# EAGLE design PowerBoard (EAGLE 7.5.0)
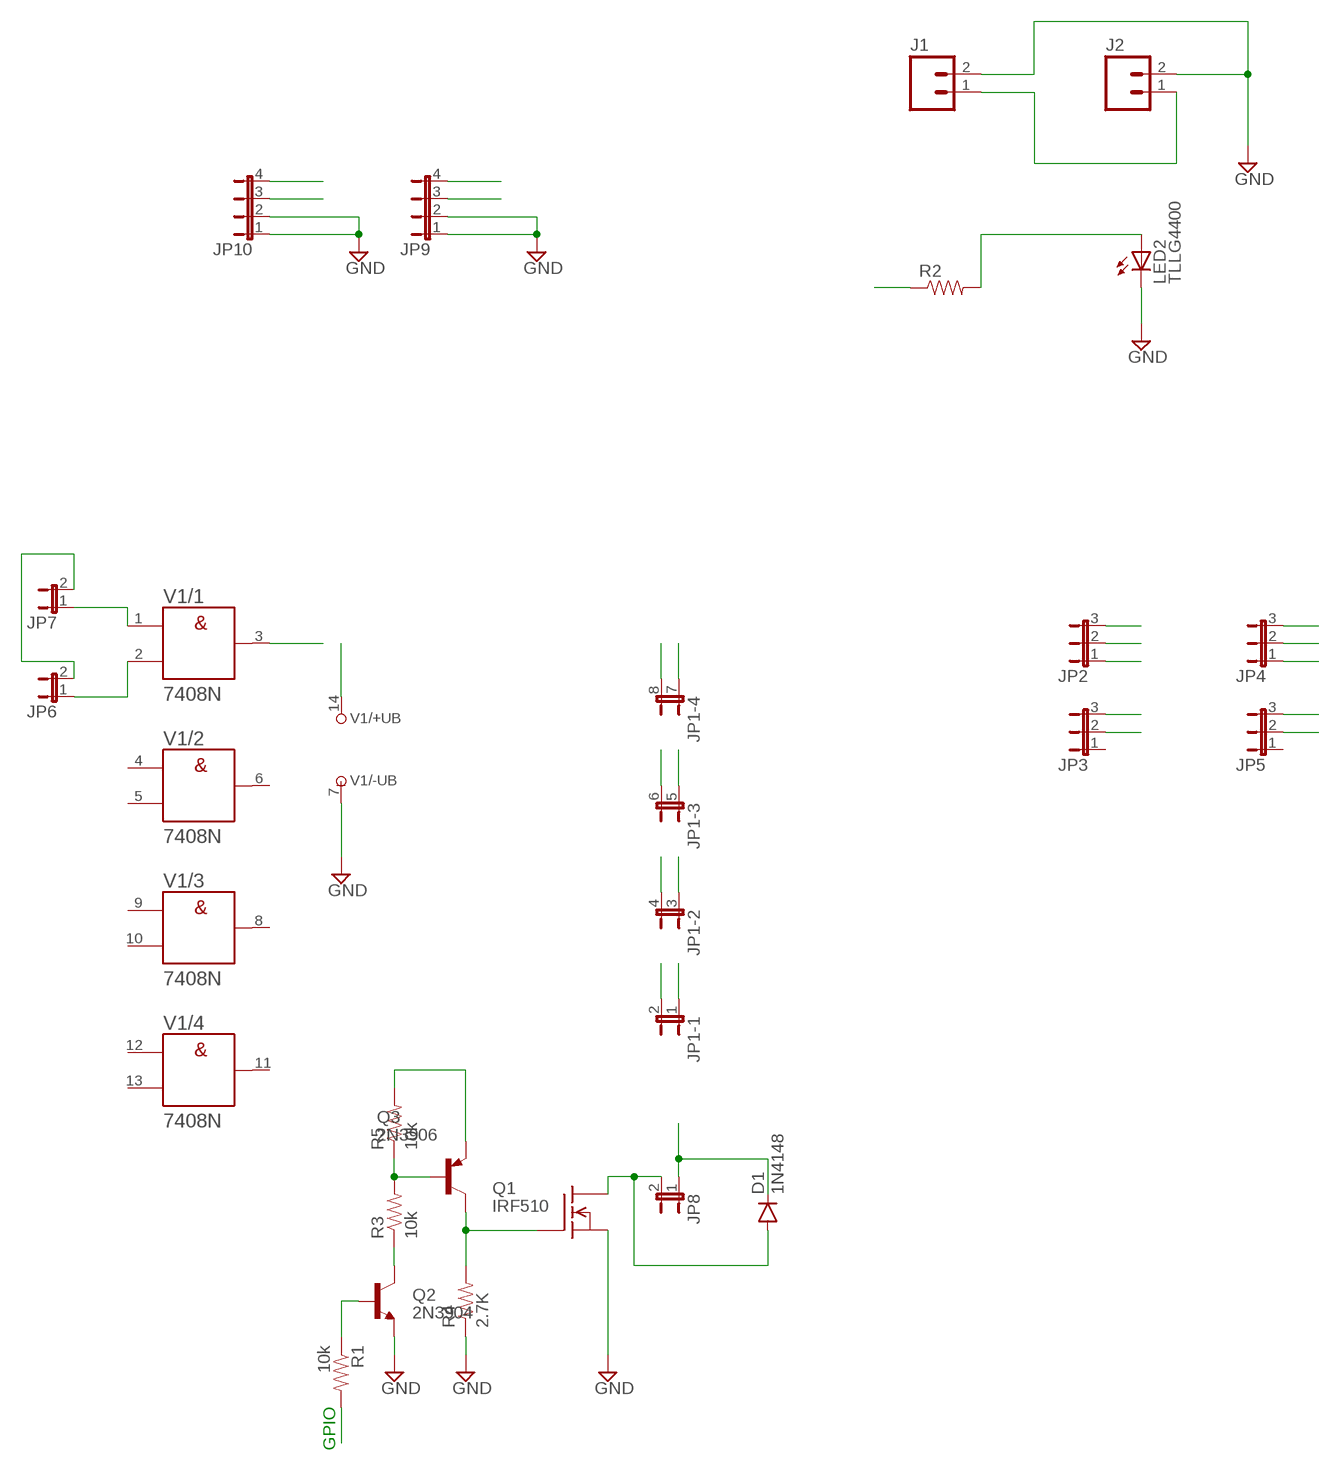
[diagram p0: schematic, sheet 1]

## Parts
D1  1N4148  DIODE1N4148  [DIODE-1N4148]
J1  M02JST-PTH-2  [JST-2-PTH]
J2  M02JST-PTH-2  [JST-2-PTH]
JP1  JP4QE  [JP4Q]
JP2  JP2E  [JP2]
JP3  JP2E  [JP2]
JP4  JP2E  [JP2]
JP5  JP2E  [JP2]
JP6  JP1E  [JP1]
JP7  JP1E  [JP1]
JP8  JP1E  [JP1]
JP9  JP4E  [JP4]
JP10  JP4E  [JP4]
LED2  TLLG4400  [LED3MM]
Q1  IRF510  [TO220]
Q2  2N3904  TRANSISTOR_NPN2N3904  [TO-92]
Q3  2N3906  [TO92]
R1  10k  RESISTORPTH-1/4W  [AXIAL-0.4]
R2  RESISTORPTH-1/4W  [AXIAL-0.4]
R3  10k  RESISTORPTH-1/4W  [AXIAL-0.4]
R4  2.7K  RESISTORPTH-1/4W  [AXIAL-0.4]
R5  10k  RESISTORPTH-1/4W  [AXIAL-0.4]
V1  7408N  [DIL14]

## Nets
1.8VCC: JP1.3 JP2.1
5VCC: JP1.7 JP4.1 JP10.3 R2.P$1 V1.14(/+UB:+UB)
15VCC: D1.C J1.1 J2.1 JP8.1 JP9.3 Q3.3(E) R5.P$2
ANDIN2: JP6.1 V1.2(/1:B)
FLOAT1: JP1.8
FLOAT2: JP1.6
FLOAT3: JP10.4
FLOAT4: JP9.4
GND: J1.2 J2.2 JP1.5 JP3.3 JP5.3 JP9.1 JP9.2 JP10.1 JP10.2 LED2.K(C) Q1.3(S) Q2.1(E) R4.P$1 V1.7(/-UB:-UB)
GPIO3: Q2.2(B) R1.P$1
HV1: JP4.3 JP6.2 JP7.2
HV2: JP4.2 V1.3(/1:Y)
HV3: JP5.2
KICKER: JP1.4 R1.P$2
LV1: JP1.1 JP2.3
LV2: JP1.2 JP2.2
LV3: JP3.2
N$1: Q2.3(C) R3.P$1
N$2: Q3.2(B) R3.P$2 R5.P$1
N$3: D1.A JP8.2 Q1.2(D)
N$4: Q1.1(G) Q3.1(C) R4.P$2
N$6: JP7.1 V1.1(/1:A)
N$7: LED2.A R2.P$2
Unconnected: JP3.1 JP5.1 V1.4(/2:A) V1.5(/2:B) V1.6(/2:Y) V1.8(/3:Y) V1.9(/3:A) V1.10(/3:B) V1.11(/4:Y) V1.12(/4:A) V1.13(/4:B)

## Notes on the sheet
- GPIO

## Library data of the parts
D1 = SparkFun-DiscreteSemi:DIODE: Diode These are standard reverse protection diodes and small signal diodes. SMA package can handle up to about 1A. SOD-323 can handle about 200mA. What the SOD-323 package when ordering, there are some mfgs out there that are 5-pin packages.; PROD_ID: DIO-08378
J1 J2 = SparkFun-Connectors:M02: Standard 2-pin 0.1" header. Use with - straight break away headers ( PRT-00116) - right angle break away headers (PRT-00553) - swiss pins (PRT-00743) - machine pins (PRT-00117) - female headers (PRT-00115) Molex polarized connector foot print use with: PRT-08233 with associated crimp pins and housings. 2.54_SCREWTERM for use with PRT-10571. 3.5mm Screw Terminal footprints for PRT-08084 5mm Screw Terminal footprints for use with PRT-08432; PROD_ID: CONN-09863; SKU: PRT-09914
JP1 = jumper:JP4QE: JUMPER
JP2-JP5 = jumper:JP2E: JUMPER
JP6-JP8 = jumper:JP1E: JUMPER
JP9 JP10 = jumper:JP4E: JUMPER
LED2 = led:TLLG4400: Low Current (2mA) LED 3 mm Tinted Diffused Package color GREEN Source: Data sheet <http://www.farnell.com/datasheets/391098.pdf>; MF: VISHAY SEMICONDUCTOR; OC_FARNELL: 1612435
Q1 = transistor-fet:IRF510: N-Channel Enhancement MOSFET (HEXFET); 100V; 5,6A; 0,54Ohm
Q2 = SparkFun-DiscreteSemi:TRANSISTOR_NPN: Generic NPN BJT MMBT2222A - TRANS-08049 (SOT-23, 1A 40V) MPSA42 - TRANS-09116 (SOT-23, 500mA 300V) MMBT5088LT1G - TRANS-11160 (SOT-23, 50 mA 30V) BC547 - COM-08928 <http://www.sparkfun.com/products/8928> (TO-92 45V 100mA) (1.Collector 2.Base 3.Emitter) 2N3904 - COM-00521 <http://www.sparkfun.com/products/521> (TO-92 40V 200mA) (1.Emitter 2.Base 3.Collector) P2N2222A - COM-12852 <http://www.sparkfun.com/products/12852> (TO-92 40V 600mA) (1.Collector 2.Base 3.Emitter); PROD_ID: TRANS-08447
Q3 = transistor-pnp:2N3906: PNP Transistor
R1 R2 = SparkFun-Resistors:RESISTOR: Resistor Basic schematic elements and footprints for 0603, 1206, and PTH resistors.
R3-R5 = SparkFun-Passives:RESISTOR: Resistor Basic schematic elements and footprints for 0603, 1206, and PTH resistors.
V1 = 74ttl-din:74*08: Quad 2-input AND gate

## Board
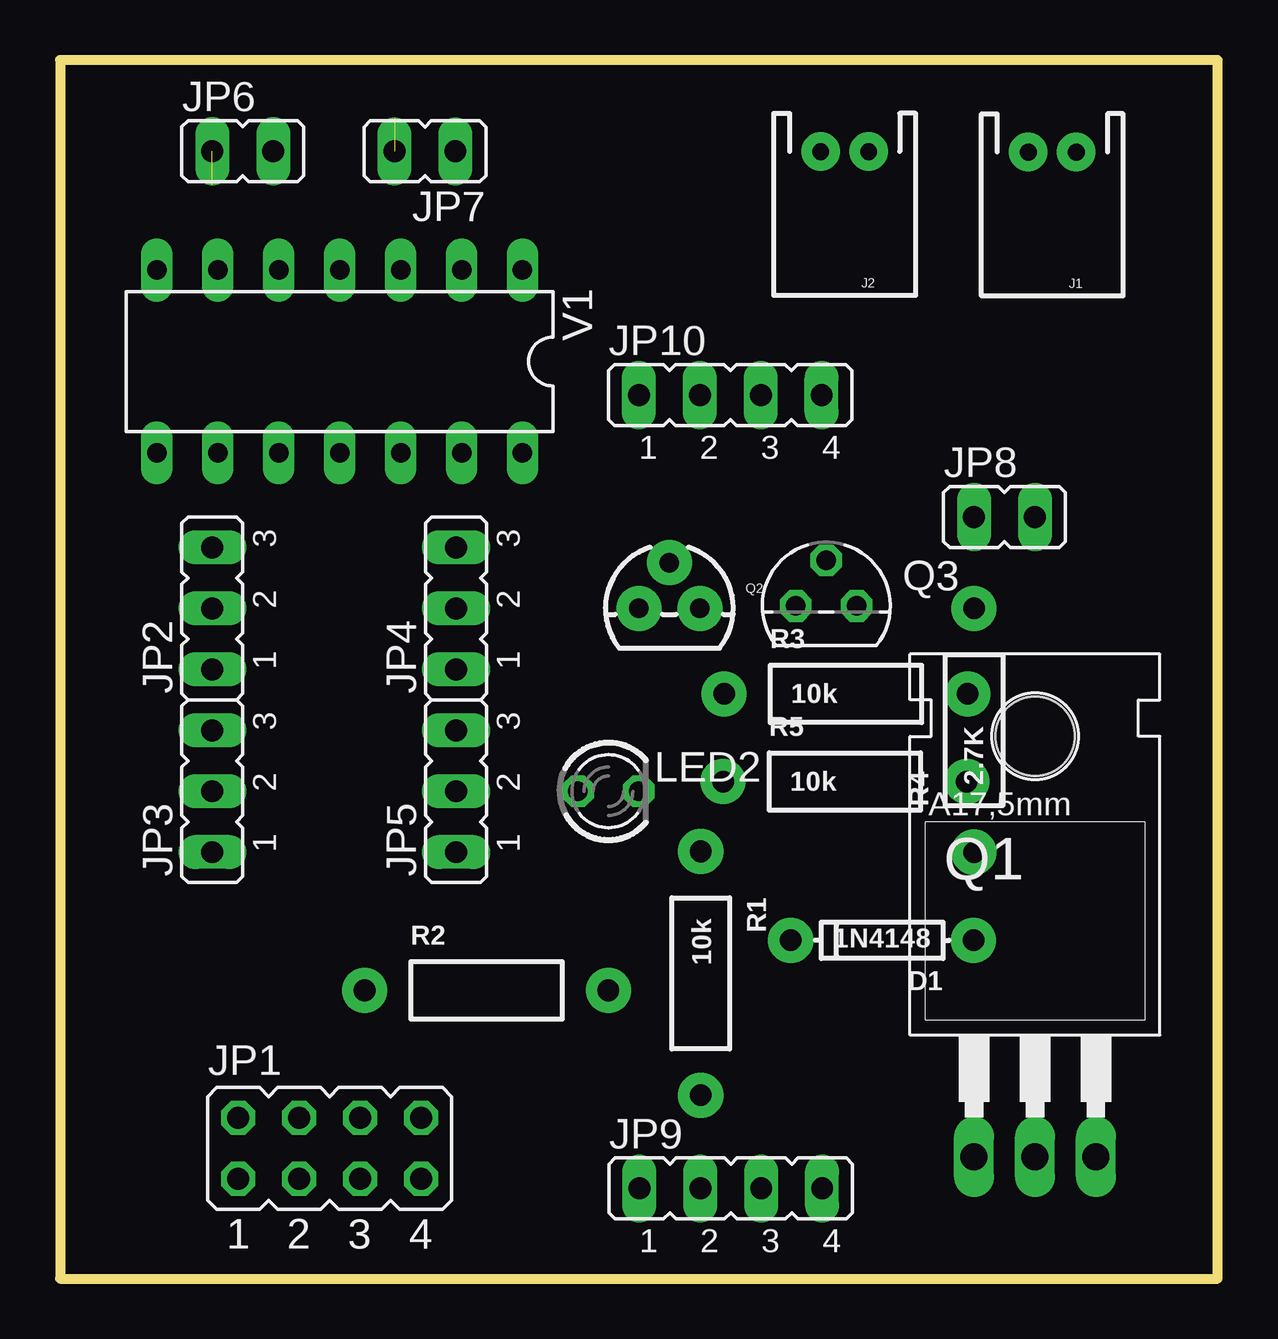
[diagram p1: board, top side]
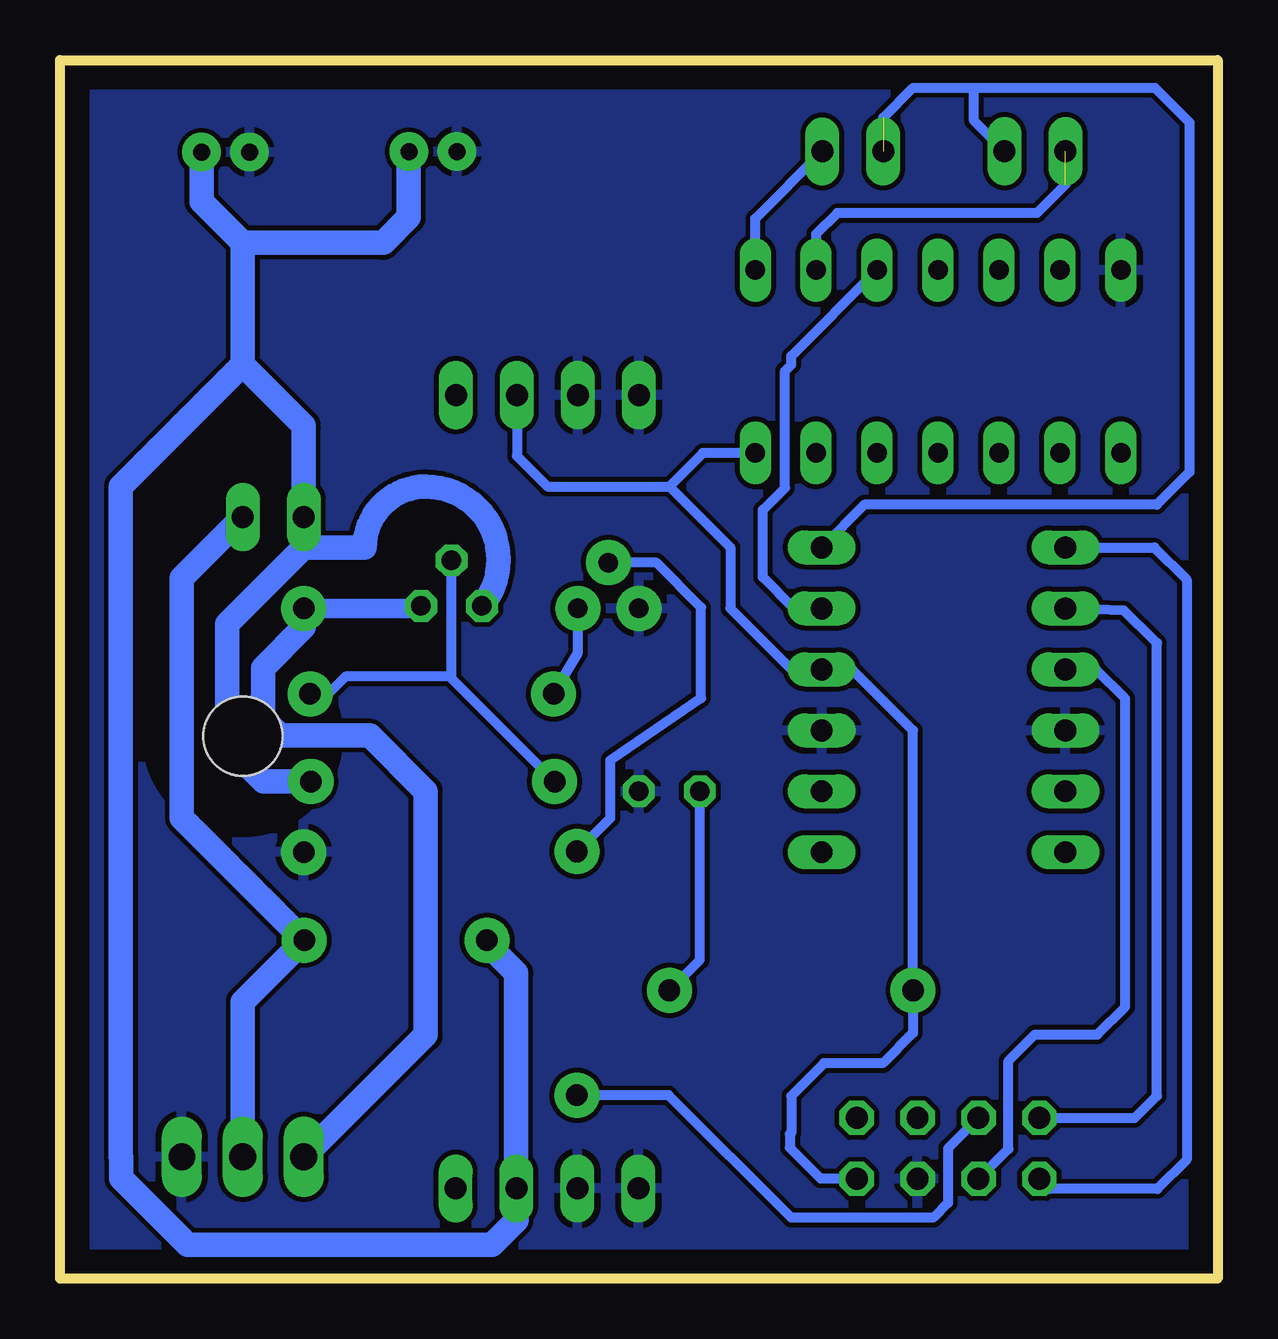
[diagram p2: board, bottom side, seen from below]

Size 48.26 x 50.8 mm. Coordinates in mm from the lower left corner, seen from the top.
Outline: 0,50.8 0,0 48.26,0 48.26,50.8 0,50.8
Copper layers (1*16): Top 0.035mm / dielectric 1.5mm / Bottom 0.035mm
Design rules "default": minimum track width 10mil, minimum drill 24mil, track to track 8mil, track to pad 8mil, pad to pad 8mil, via to via 8mil, smd to smd 8mil, copper to edge 40mil, drill to drill 8mil, minimum pad ring 10mil, minimum via ring 8mil, stop-mask expansion 4mil, vias tented up to drill 0mil, thermal gap 10mil

### Footprints (pad centres in the part's own frame; a part is rotated, then mirrored left to right if it is on the bottom)
DIODE-1N4148 = drill 0.9 pad 1.88: A -3.81,0; C 3.81,0
JST-2-PTH = drill 0.7 pad 1.6: 1 -1,0; 2 1,0
JP4Q = drill 0.914 octagon: 1 -3.81,-1.27; 2 -3.81,1.27; 3 -1.27,-1.27; 4 -1.27,1.27; 5 1.27,-1.27; 6 1.27,1.27; 7 3.81,-1.27; 8 3.81,1.27
JP2 = drill 0.914 long: 1 -2.54,0; 2 0,0; 3 2.54,0
JP1 = drill 0.914 long: 1 0,-1.27; 2 0,1.27
JP4 = drill 0.914 long: 1 -3.81,0; 2 -1.27,0; 3 1.27,0; 4 3.81,0
LED3MM = drill 0.813 octagon: A -1.27,0; K 1.27,0
TO220 = drill 1.118 long: 1 -2.54,-6.35; 2 0,-6.35; 3 2.54,-6.35 | hole 3.302: 0,11.176
TO-92 = drill 0.813 pad 1.88: 1 -1.27,0; 2 0,1.905; 3 1.27,0
TO92 = drill 0.813 octagon: 1 1.27,0; 2 0,1.905; 3 -1.27,0
AXIAL-0.4 = drill 0.9 pad 1.88: P$1 -5.08,0; P$2 5.08,0
DIL14 = drill 0.813 long: 1 -7.62,-3.81; 2 -5.08,-3.81; 3 -2.54,-3.81; 4 0,-3.81; 5 2.54,-3.81; 6 5.08,-3.81; 7 7.62,-3.81; 8 7.62,3.81; 9 5.08,3.81; 10 2.54,3.81; 11 0,3.81; 12 -2.54,3.81; 13 -5.08,3.81; 14 -7.62,3.81

### Placement (x,y rotation side)
D1  34.27,14.11 180 top
J1  41.36,46.96 180 top
J2  32.71,46.98 180 top
JP1  11.24,5.43 0 top
JP2  6.35,27.94 90 top
JP3  6.35,20.32 90 top
JP4  16.51,27.94 90 top
JP5  16.51,20.32 90 top
JP6  7.62,47 270 top
JP7  15.21,46.99 90 top
JP8  39.37,31.75 270 top
JP9  27.96,3.76 0 top
JP10  27.94,36.83 0 top
LED2  22.86,20.32 0 top
Q1  40.64,11.43 0 top
Q2  25.4,27.94 0 top
Q3  31.94,28.04 0 top
R1  26.71,12.73 270 top
R2  17.78,12.02 0 top
R3  32.76,24.38 0 top
R4  38.1,22.86 90 top
R5  32.72,20.72 0 top
V1  11.66,38.23 180 top

### Tracks (layer width: path | path; a pad name or v marks a point on that pad's centre or on a via)
1.8VCC
  Bottom 0.406: JP1.3 8.72,5.41 8.72,9.08 7.62,10.18 5.02,10.18 3.86,11.34 3.86,24.18 5.08,25.4 JP2.1
5VCC
  Bottom 0.406: JP10.3 29.21,34.29 27.94,33.02 22.86,33.02 | 22.86,33.02 20.32,30.48 20.32,27.94 17.78,25.4 JP4.1 15.24,25.4 12.7,22.86 R2.P$1 12.7,10.24 13.96,8.98 16.42,8.98 17.78,7.62 17.78,6.08 17.84,6.02 17.84,5.46 16.56,4.18 15.07,4.18 JP1.7 | V1.14 21.46,34.42 22.86,33.02
15VCC
  Bottom 0.406: JP8.1 38.1,30.48
  Bottom 1.016: J2.1 33.72,44.24 34.78,43.18 40.64,43.18 | 40.64,43.18 42.36,44.9 J1.1 | 40.64,43.18 40.64,38.1 | 40.64,38.1 45.72,33.02 45.72,5.08 45.7,5.06 45.7,4.18 42.94,1.42 30.24,1.42 29.23,2.43 JP9.3 29.24,12.74 30.46,13.96 D1.C | JP8.1 38.1,35.56 40.64,38.1 | Q3.3 arc-129 33.02,33.02 arc-90 35.56,30.48 38.1,30.48 41.3,27.28 41.3,22.24 39.78,20.72 R5.P$2
ANDIN2  (1 unrouted)
  Bottom 0.406: 6.35,45.61 7.54,44.42 15.86,44.42 16.74,43.54 V1.2
GND
  pour Bottom: 0,0 0,50.8 48.26,50.8 48.26,0
GPIO3
  Bottom 0.406: R1.P$1 25.32,19.2 25.32,21.62 21.54,24.2 21.54,27.98 23.4,29.84 Q2.2
HV1  (1 unrouted)
  Bottom 0.406: 13.94,48.4 12.7,49.64 10.16,49.64 | 10.16,49.64 2.62,49.64 1.18,48.2 1.18,33.62 2.54,32.26 14.73,32.26 JP4.3 | JP6.2 10.16,48.27 10.16,49.64
HV2
  Bottom 0.406: JP4.2 17.66,27.94 18.96,29.24 18.96,32.04 18.04,32.96 18.04,37.84 17.78,38.1 17.78,38.46 V1.3
KICKER
  Bottom 0.406: JP1.4 11.24,5.43 11.24,3.16 11.86,2.54 17.78,2.54 22.89,7.65 R1.P$2
LV1
  Bottom 0.406: JP2.3 2.64,30.48 1.3,29.14 1.3,4.96 2.52,3.74 7.01,3.74 JP1.1
LV2
  Bottom 0.406: JP1.2 3.46,6.7 2.54,7.62 2.54,26.5 2.64,26.6 3.92,27.86 JP2.2
N$1
  Bottom 0.406: R3.P$1 26.67,26.09 Q2.3
N$2
  Bottom 0.406: R5.P$1 31.94,25.02 | 31.94,25.02 Q3.2 | 31.94,25.02 32.02,25.1 36.36,25.1 37.08,24.38 R3.P$2
N$3
  Bottom 1.016: Q1.2 40.64,11.55 D1.A 43.18,19.21 43.18,29.21 JP8.2
N$4
  Bottom 0.813: Q3.1 33.31,27.94 R4.P$2
  Bottom 1.016: Q1.1 33.02,10.16 33.02,20.32 35.34,22.64 39.08,22.64 39.8,23.36 39.8,25.46 38.1,27.16 R4.P$2
N$6
  Bottom 0.406: V1.1 19.28,44.19 JP7.1
N$7
  Bottom 0.406: R2.P$2 21.59,13.29 LED2.A